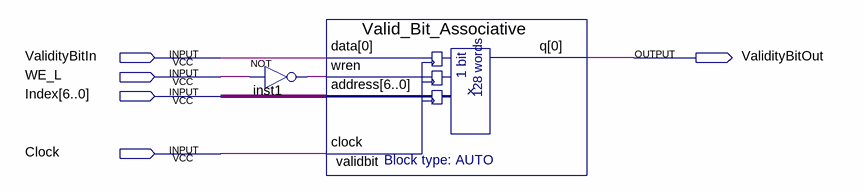
[diagram p0: schematic sheet]
// Quartus schematic ValidBit_Associative.bdf as structural Verilog: 2 symbols, 5 pins
module ValidBit_Associative (
  input  ValidityBitIn,
  input  WE_L,
  input  [6:0] Index,
  input  Clock,
  output ValidityBitOut
);

  wire inst1_out;

  not inst1 (inst1_out, WE_L);
  Valid_Bit_Associative validbit (
    .data(ValidityBitIn), .wren(inst1_out), .address(Index), .clock(Clock), .q(ValidityBitOut));
endmodule
